# Altium schematic sheet Output.Schematic.SchDoc
size A
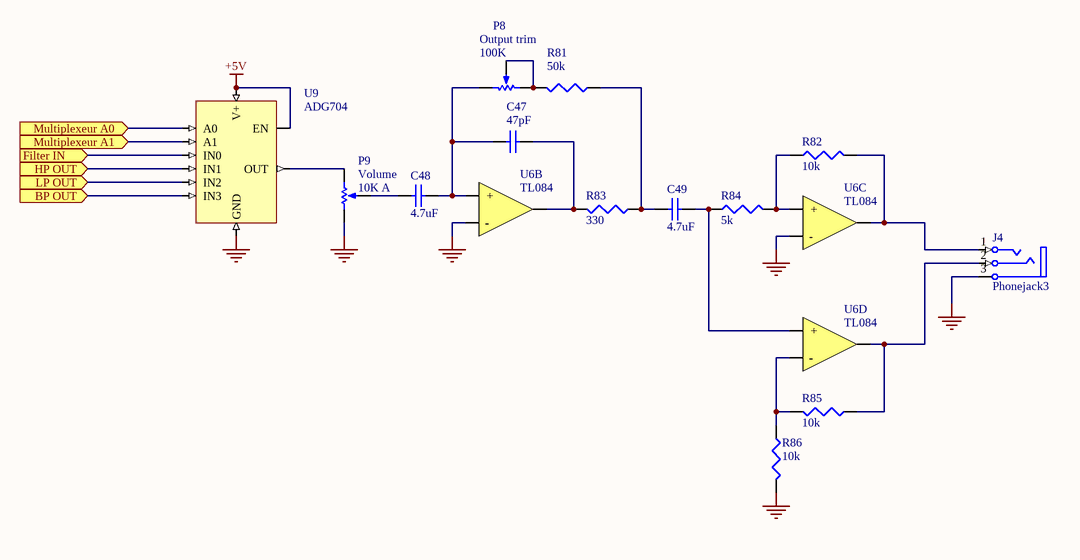
[diagram p0: Output.Schematic.SchDoc]

## Parts
C47  47pF  [CAPC1608N]
C48  4.7uF  [CAPC1608N]
C49  4.7uF  [CAPC1608N]
J4  Phonejack3  [Header 3]
P8  Output trim  value 100K  [BOURNS Trim pot]
P9  Volume  value 10K A  [ALPS Potentiometer]
R81  50k  [CAPC1608N]
R82  10k  [CAPC1608N]
R83  330  [CAPC1608N]
R84  5k  [CAPC1608N]
R85  10k  [CAPC1608N]
R86  10k  [CAPC1608N]
U6B  TL084  [TL084 - 3pads]
U6C  TL084  [TL084 - 3pads]
U6D  TL084  [TL084 - 3pads]
U9  ADG704  [ADG704]

## Ports
BP OUT (in), Filter IN (in), HP OUT (in), LP OUT (in), Multiplexeur A0 (in), Multiplexeur A1 (in)

## Nets
+5V: U9.5(EN) U9.6(V+)
GND: J4.3(S) P9.1(TOP) R86.2 U6B.2(-) U6C.2(-) U9.3(GND)
BP OUT: U9.7(IN3) ; port BP OUT
Filter IN: U9.2(IN0) ; port Filter IN
HP OUT: U9.9(IN1) ; port HP OUT
LP OUT: U9.4(IN2) ; port LP OUT
Multiplexeur A0: U9.1(A0) ; port Multiplexeur A0
Multiplexeur A1: U9.10(A1) ; port Multiplexeur A1
NetC47_1: C47.1 C48.2 P8.1(TOP) U6B.3(+)
NetC47_2: C47.2 R83.2 U6B.1(OUT)
NetC48_1: C48.1 P9.3(TAP)
NetC49_1: C49.1 R81.1 R83.1
NetC49_2: C49.2 R84.1 U6D.3(+)
NetJ4_1: J4.1(T) R82.2 U6C.1(OUT)
NetJ4_2: J4.2(R) R85.1 U6D.1(OUT)
NetP8_2: P8.2(BOT) P8.3(TAP) R81.2
NetP9_2: P9.2(BOT) U9.8(OUT)
NetR82_1: R82.1 R84.2 U6C.3(+)
NetR85_2: R85.2 R86.1 U6D.2(-)

## Library data of the parts
C47 = Cap Semi: Capacitor (Semiconductor SIM Model); Published: 8-Jun-2000; LatestRevisionDate: 29-May-2009; LatestRevisionNote: IPC-7351 Footprint Added.; PackageReference: C1206; Publisher: Altium Limited; PackageDescription: Chip Capacitor; Value: 47pF
C48 C49 = Cap Semi: Capacitor (Semiconductor SIM Model); Value: 4.7u; Published: 8-Jun-2000; LatestRevisionDate: 29-May-2009; LatestRevisionNote: IPC-7351 Footprint Added.; PackageReference: C1206; Publisher: Altium Limited; PackageDescription: Chip Capacitor
J4 = Phonejack3: Jack Socket, 1/4" [6.5mm], Thru-Hole, Vertical, 3-Conductor Open Circuit (Non-Normalling); PackageDocument: 2003; PCB_Layout: Complies with manufacturer's recommendation.; DrillAndSlotSize: Corresponds to nominal value.; Published: 15-Jul-2004; LatestRevisionDate: 15-Jul-2004; LatestRevisionNote: Component Replaced.; DatasheetDocument: 2003; PackageReference: S1VS_SSS; Publisher: Altium Limited; ComponentLink1Description: Manufacturer Link; ComponentLink1URL: http://www.cliffuk.co.uk/
P8 = RPot: Potentiometer; Sim Note: Enter the Resistance value and the set point into parameter fields.; Set Position: 0.5; Fabricant: Bourns; Ref_Fabricant: 3362P-1-103LF; Published: 8-Jun-2000; LatestRevisionDate: 17-Jul-2002; LatestRevisionNote: Re-released for DXP Platform.; PackageReference: VR5; Publisher: Altium Limited; PackageDescription: Variable Resistor, Thru-Hole; 3 Leads; Datasheet: http://www.farnell.com/datasheets/2034958.pdf; Ref_Farnell: 9354301
P9 = RPot: Potentiometer; Sim Note: Enter the Resistance value and the set point into parameter fields.; Set Position: 0.5; Ref_Fabricant: RK09K1130C94; Fabricant: ALPS; Published: 8-Jun-2000; LatestRevisionDate: 17-Jul-2002; LatestRevisionNote: Re-released for DXP Platform.; PackageReference: VR5; Publisher: Altium Limited; PackageDescription: Variable Resistor, Thru-Hole; 3 Leads; Datasheet: http://www.farnell.com/datasheets/1718712.pdf; Ref_Farnell: 1191742
R81-R86 = Res3: Resistor; Published: 8-Jun-2000; LatestRevisionDate: 29-May-2009; LatestRevisionNote: IPC-7351 Footprint Added.; PackageReference: J1-0603; Publisher: Altium Limited; PackageDescription: Chip Resistor
  R81: Value: 50K
  R82 R85 R86: Value: 10K
  R83: Value: 330
  R84: Value: 5K
U6B U6D = TL084: Ref_Fabricant: TL084BCD; Fabricant: Fairshild Semiconductor; Ref_Farnell: 9593438; Datasheet: http://www.farnell.com/datasheets/1882473.pdf
U6C = TL084: Ref_Fabricant: TL084BCD; Fabricant: Fairchild Semiconductor; Ref_Farnell: 9593438; Datasheet: http://www.farnell.com/datasheets/1882473.pdf
U9 = ADG704: Ref_Fabricant: MC100EP57DTG; Fabricant: On Semiconductor; Datasheet: http://www.farnell.com/datasheets/1915143.pdf; Ref_Farnell: 1468710